# EAGLE schematic Stepper board_dual_voltage_v2 (EAGLE 9.3.1)
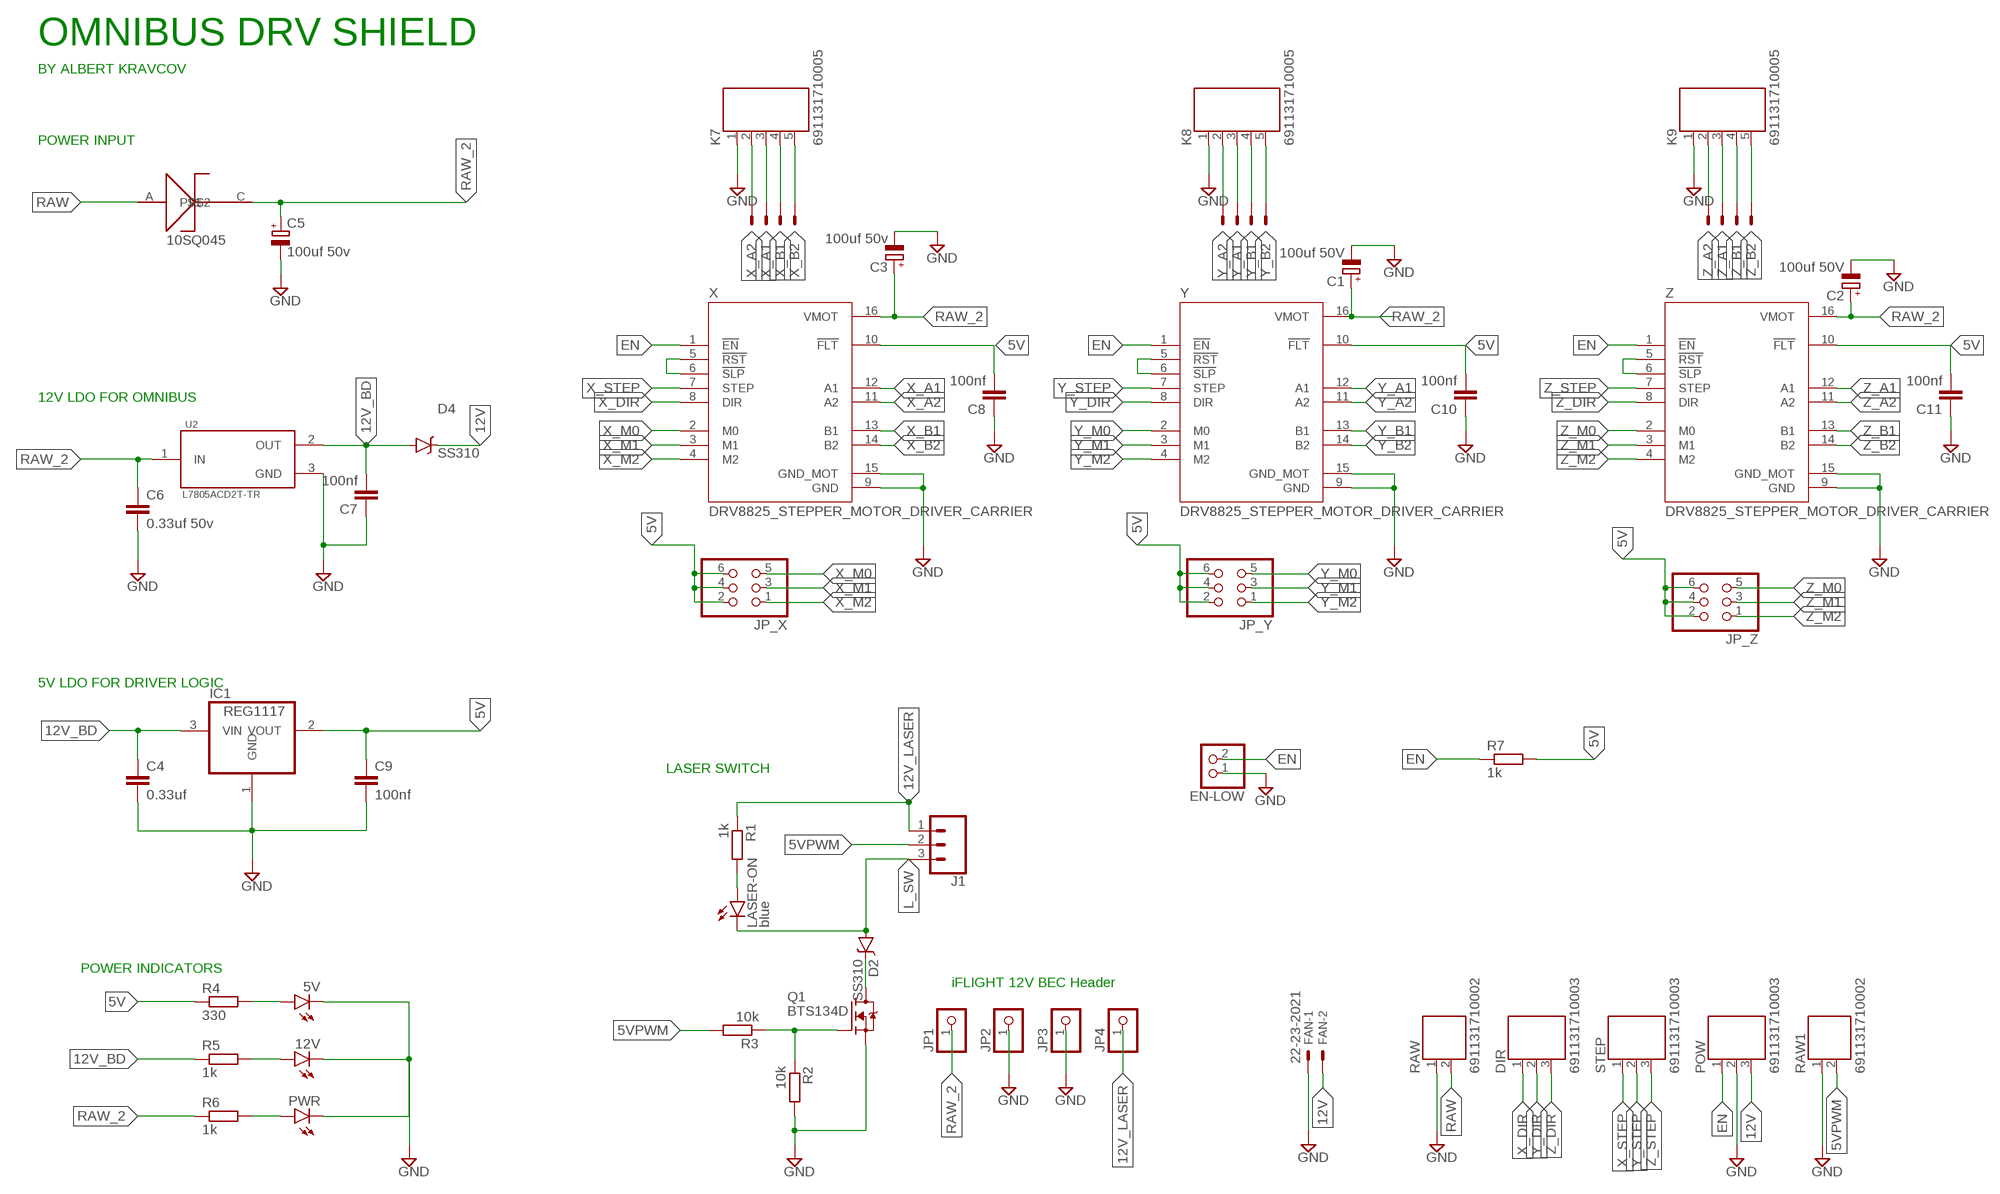
[diagram p0: schematic, sheet 1]

## Parts
5V  LEDCHIPLED_0805  [CHIPLED_0805]
12V  LEDCHIPLED_0805  [CHIPLED_0805]
C1  100uf 50V  CPOL-EUE5-6  [E5-6]
C2  100uf 50V  CPOL-EUE5-6  [E5-6]
C3  100uf 50v  CPOL-EUE5-6  [E5-6]
C4  0.33uf  C-EUC1206  [C1206]
C5  100uf 50v  CPOL-EUE5-8.5  [E5-8,5]
C6  0.33uf 50v  C-EUC1206  [C1206]
C7  100nf  C-EUC0805  [C0805]
C8  100nf  C-EUC0805  [C0805]
C9  100nf  C-EUC0805  [C0805]
C10  100nf  C-EUC0805  [C0805]
C11  100nf  C-EUC0805  [C0805]
D1  10SQ045  10SQ050  [DIOAD885W125L910D885]
D2  SS310  SS54  [DO-214AC]
D4  SS310  SS54  [DO-214AC]
DIR  691131710003  [691131710003]
EN-LOW  PINHD-1X2  [1X02]
FAN  22-23-2021  [22-23-2021]
IC1  REG1117  [SOT223]
J1  CONN_03  [1X03]
JP1  PINHD-1X1  [1X01]
JP2  PINHD-1X1  [1X01]
JP3  PINHD-1X1  [1X01]
JP4  PINHD-1X1  [1X01]
JP_X  PINHD-2X3  [2X03]
JP_Y  PINHD-2X3  [2X03]
JP_Z  PINHD-2X3  [2X03]
K7  691131710005  [691131710005]
K8  691131710005  [691131710005]
K9  691131710005  [691131710005]
LASER-ON  blue  LEDCHIPLED_0805  [CHIPLED_0805]
POW  691131710003  [691131710003]
PWR  LEDCHIPLED_0805  [CHIPLED_0805]
Q1  BTS134D  FQD7N10LTM  [TO-252]
R1  1k  R-EU_R0805  [R0805]
R2  10k  R-EU_R0805  [R0805]
R3  10k  R-EU_R0805  [R0805]
R4  330  R-EU_R0805  [R0805]
R5  1k  R-EU_R0805  [R0805]
R6  1k  R-EU_R1206  [R1206]
R7  1k  R-EU_R0805  [R0805]
RAW  691131710002  [691131710002]
RAW1  691131710002  [691131710002]
STEP  691131710003  [691131710003]
U2  L7805ACD2T-TR  [TO254P1515X470-3N]
X  DRV8825_STEPPER_MOTOR_DRIVER_CARRIER  [IC_DRV8825_STEPPER_MOTOR_DRIVER_CARRIER]
X_MOTOR  22-23-2041  [22-23-2041]
Y  DRV8825_STEPPER_MOTOR_DRIVER_CARRIER  [IC_DRV8825_STEPPER_MOTOR_DRIVER_CARRIER]
Y_MOTOR  22-23-2041  [22-23-2041]
Z  DRV8825_STEPPER_MOTOR_DRIVER_CARRIER  [IC_DRV8825_STEPPER_MOTOR_DRIVER_CARRIER]
Z_MOTOR  22-23-2041  [22-23-2041]

## Nets
5V [power]: C8.2 C9.1 C10.2 C11.2 IC1.2(VOUT) JP_X.2 JP_X.4 JP_X.6 JP_Y.2 JP_Y.4 JP_Y.6 JP_Z.2 JP_Z.4 JP_Z.6 R4.1 R7.2 X.10(!FLT) Y.10(!FLT) Z.10(!FLT)
5VPWM [power]: J1.2 R3.2 RAW1.2
12V [ha]: D4.C FAN.2 POW.3
12V_BD [ha]: C4.1 C7.2 D4.A IC1.3(VIN) R5.1 U2.2(OUT)
12V_LASER [ha]: J1.1 JP4.1 R1.1
EN: EN-LOW.2 POW.1 R7.1 X.1(!EN) Y.1(!EN) Z.1(!EN)
GND: 5V.C 12V.C C1.- C2.- C3.- C4.2 C5.- C6.2 C7.1 C8.1 C9.2 C10.1 C11.1 EN-LOW.1 FAN.1 IC1.1(GND) JP2.1 JP3.1 K7.1 K8.1 K9.1 POW.2 PWR.C Q1.3(S) R2.2 RAW1.1 RAW.1 U2.3(GND) X.9(GND) X.15(GND_MOT) Y.9(GND) Y.15(GND_MOT) Z.9(GND) Z.15(GND_MOT)
L_SW [power]: D2.A J1.3 LASER-ON.C
N$1: Q1.1(G) R2.1 R3.1
N$2: 5V.A R4.2
N$3: LASER-ON.A R1.2
N$4 [power]: D2.C Q1.T(D)
N$7: 12V.A R5.2
N$10: PWR.A R6.2
NC [power]: Z.5(!RST) Z.6(!SLP)
NC2 [power]: Y.5(!RST) Y.6(!SLP)
NC3 [power]: X.5(!RST) X.6(!SLP)
RAW [ha]: D1.A RAW.2
RAW_2 [ha]: C1.+ C2.+ C3.+ C5.+ C6.1 D1.C JP1.1 R6.1 U2.1(IN) X.16(VMOT) Y.16(VMOT) Z.16(VMOT)
X_A1 [ha]: K7.3 X.12(A1) X_MOTOR.3
X_A2 [ha]: K7.2 X.11(A2) X_MOTOR.4
X_B1 [ha]: K7.4 X.13(B1) X_MOTOR.2
X_B2 [ha]: K7.5 X.14(B2) X_MOTOR.1
X_DIR [power]: DIR.1 X.8(DIR)
X_M0: JP_X.5 X.2(M0)
X_M1: JP_X.3 X.3(M1)
X_M2: JP_X.1 X.4(M2)
X_STEP [power]: STEP.1 X.7(STEP)
Y_A1 [ha]: K8.3 Y.12(A1) Y_MOTOR.3
Y_A2 [ha]: K8.2 Y.11(A2) Y_MOTOR.4
Y_B1 [ha]: K8.4 Y.13(B1) Y_MOTOR.2
Y_B2 [ha]: K8.5 Y.14(B2) Y_MOTOR.1
Y_DIR [power]: DIR.2 Y.8(DIR)
Y_M0: JP_Y.5 Y.2(M0)
Y_M1: JP_Y.3 Y.3(M1)
Y_M2: JP_Y.1 Y.4(M2)
Y_STEP [power]: STEP.2 Y.7(STEP)
Z_A1 [ha]: K9.3 Z.12(A1) Z_MOTOR.3
Z_A2 [ha]: K9.2 Z.11(A2) Z_MOTOR.4
Z_B1 [ha]: K9.4 Z.13(B1) Z_MOTOR.2
Z_B2 [ha]: K9.5 Z.14(B2) Z_MOTOR.1
Z_DIR [power]: DIR.3 Z.8(DIR)
Z_M0: JP_Z.5 Z.2(M0)
Z_M1: JP_Z.3 Z.3(M1)
Z_M2: JP_Z.1 Z.4(M2)
Z_STEP [power]: STEP.3 Z.7(STEP)

## Notes on the sheet
- OMNIBUS DRV SHIELD
- BY ALBERT KRAVCOV
- POWER INPUT
- 10SQ045
- 12V LDO FOR OMNIBUS
- 5V LDO FOR DRIVER LOGIC
- LASER SWITCH
- POWER INDICATORS
- iFLIGHT 12V BEC Header

## Library data of the parts
5V 12V LASER-ON PWR = led:LED: LED OSRAM: - CHIPLED LG R971, LG N971, LY N971, LG Q971, LY Q971, LO R971, LY R971 LH N974, LH R974 LS Q976, LO Q976, LY Q976 LO Q996 - Hyper CHIPLED LW Q18S LB Q993, LB Q99A, LB R99A - SideLED LS A670, LO A670, LY A670, LG A670, LP A670 LB A673, LV A673, LT A673, LW A673 LH A674 LY A675 LS A676, LA A676, LO A676, LY A676, LW A676 LS A679, LY A679, LG A679 - Hyper Micro SIDELED® LS Y876, LA Y876, LO Y876, LY Y876 LT Y87S - SmartLED LW L88C, LW L88S LB L89C, LB L89S, LG L890 LS L89K, LO L89K, LY L89K LS L896, LA L896, LO L896, LY L896 - TOPLED LS T670, LO T670, LY T670, LG T670, LP T670 LSG T670, LSP T670, LSY T670, LOP T670, LYG T670 LG T671, LOG T671, LSG T671 LB T673, LV T673, LT T673, LW T673 LH T674 LS T676, LA T676, LO T676, LY T676, LB T676, LH T676, LSB T676, LW T676 LB T67C, LV T67C, LT T67C, LS T67K, LO T67K, LY T67K, LW E67C LS E67B, LA E67B, LO E67B, LY E67B, LB E67C, LV E67C, LT E67C LW T67C LS T679, LY T679, LG T679 LS T770, LO T770, LY T770, LG T770, LP T770 LB T773, LV T773, LT T773, LW T773 LH T774 LS E675, LA E675, LY E675, LS T675 LS T776, LA T776, LO T776, LY T776, LB T776 LHGB T686 LT T68C, LB T68C - Hyper Mini TOPLED® LB M676 - Mini TOPLED Santana® LG M470 LS M47K, LO M47K, LY M47K Source: http://www.osram.convergy.de LUXEON: - LUMILED® LXK2-PW12-R00, LXK2-PW12-S00, LXK2-PW14-U00, LXK2-PW14-V00 LXK2-PM12-R00, LXK2-PM12-S00, LXK2-PM14-U00 LXK2-PE12-Q00, LXK2-PE12-R00, LXK2-PE12-S00, LXK2-PE14-T00, LXK2-PE14-U00 LXK2-PB12-K00, LXK2-PB12-L00, LXK2-PB12-M00, LXK2-PB14-N00, LXK2-PB14-P00, LXK2-PB14-Q00 LXK2-PR12-L00, LXK2-PR12-M00, LXK2-PR14-Q00, LXK2-PR14-R00 LXK2-PD12-Q00, LXK2-PD12-R00, LXK2-PD12-S00 LXK2-PH12-R00, LXK2-PH12-S00 LXK2-PL12-P00, LXK2-PL12-Q00, LXK2-PL12-R00 Source: www.luxeon.com KINGBRIGHT: KA-3528ASYC Source: www.kingbright.com
C1-C3 C5 = rcl:CPOL-EU: POLARIZED CAPACITOR, European symbol; SPICEPREFIX: C
C4 C6-C11 = rcl:C-EU: CAPACITOR, European symbol; SPICEPREFIX: C
D1 = DIOAD885W125L910D885:10SQ050
D2 D4 = SS54:SS54: SCHOTTKY DIODES 40Vpeak, 28Vrms 5A (SBD) SMA(DO-214AC); AVAILABILITY: Unavailable; DESCRIPTION: Digital Switch Unipolar Switch Open Collector Hall Effect SOT-89B; MF: Honeywell Sensing; MP: SS54; PACKAGE: TO-243AA-243 Honeywell Sensing; PRICE: None
DIR POW STEP = Wurth_Terminal_Blocks_Connectors_rev15d:691131710003: WR-TBL Terminal block - CUU5/3 - 3 Pins;=>Code : Con_TBL_Screw_PClamp_5.00_6911317100xx_691131710003 <http://katalog.we-online.de/media/images/eican/Con_TBL_Screw_PClamp_5.00_6911317100xx_pf2.jpg> Details see: http://katalog.we-online.de/em/datasheet/6911317100xx.pdf Created 11/3/2014, Karrer Zheng 2014 (C) Wurth Elektronik
EN-LOW = pinhead:PINHD-1X2: PIN HEADER
FAN = con-molex:22-23-2021: .100" (2.54mm) Center Header - 2 Pin; MF: MOLEX; MPN: 22-23-2021; OC_FARNELL: 1462926; OC_NEWARK: 25C3832
IC1 = burr-brown:REG1117: 800mA and 1A Low Dropout (LDO) Positive Regulator 1.8V, 2.5V, 2.85V, 3.3V, 5V, and Adj; MPN: REG1117; OC_FARNELL: 1097566; OC_NEWARK: 14P6981
J1 = SparkFun-Connectors:CONN_03: Multi connection point. Often used as Generic Header-pin footprint for 0.1 inch spaced/style header connections On any of the 0.1 inch spaced packages, you can populate with these: Break Away Headers - Straight <https://www.sparkfun.com/products/116> (PRT-00116) Break Away Male Headers - Right Angle <https://www.sparkfun.com/products/553> (PRT-00553) Female Headers <https://www.sparkfun.com/products/115> (PRT-00115) Break Away Headers - Machine Pin <https://www.sparkfun.com/products/117> (PRT-00117) Break Away Female Headers - Swiss Machine Pin <https://www.sparkfun.com/products/743> (PRT-00743) Stackable Header - 3 Pin (Female, 0.1") <https://www.sparkfun.com/products/13875> (PRT-13875) For SCREWTERMINALS and SPRING TERMINALS visit here: Screw Terimnals on SparkFun.com <https://www.sparkfun.com/search/results?term=Screw+Terminals> (5mm/3.5mm/2.54mm spacing) This device is also useful as a general connection point to wire up your design to another part of your project. Our various solder wires solder well into these plated through hole pads. Hook-Up Wire - Assortment (Stranded, 22 AWG) <https://www.sparkfun.com/products/11375> (PRT-11375) Hook-Up Wire - Assortment (Solid Core, 22 AWG) <https://www.sparkfun.com/products/11367> (PRT-11367) View the entire wire category on our website here <https://www.sparkfun.com/categories/141> Special notes: Molex polarized connector foot print use with SKU : PRT-08232 with associated crimp pins and housings.
JP1-JP4 = pinhead:PINHD-1X1: PIN HEADER
JP_X JP_Y JP_Z = pinhead:PINHD-2X3: PIN HEADER
K7-K9 = Wurth_Terminal_Blocks_Connectors_rev15d:691131710005: WR-TBL Terminal block - CUU5/5 - 5 Pins;=>Code : Con_TBL_Screw_PClamp_5.00_6911317100xx_691131710005 <http://katalog.we-online.de/media/images/eican/Con_TBL_Screw_PClamp_5.00_6911317100xx_pf2.jpg> Details see: http://katalog.we-online.de/em/datasheet/6911317100xx.pdf Created 11/3/2014, Karrer Zheng 2014 (C) Wurth Elektronik
Q1 = FQD7N10LTM:FQD7N10LTM: MOSFET N-CH 100V 5.8A 350mOhm 6nC DPAK Check prices <https://pricing.snapeda.com/parts/FQD7N10LTM/ON%20Semiconductor/view-part?ref=eda>; AVAILABILITY: Good; DESCRIPTION: N-Channel 100V 5.8A (Tc) 2.5W (Ta), 25W (Tc) Surface Mount D-Pak; MF: ON Semiconductor; MP: FQD7N10LTM; PACKAGE: TO-252-3 ON Semiconductor; PRICE: None; PURCHASE-URL: https://pricing.snapeda.com/search/part/FQD7N10LTM/?ref=eda
R1-R7 = rcl:R-EU_: RESISTOR, European symbol; SPICEPREFIX: R
RAW RAW1 = Wurth_Terminal_Blocks_Connectors_rev15d:691131710002: WR-TBL Terminal block - CUU5/2 CUU5/2GR - 2 Pins;=>Code : Con_TBL_Screw_PClamp_5.00_6911317100xx_691131710002 <http://katalog.we-online.de/media/images/eican/Con_TBL_Screw_PClamp_5.00_6911317100xx_pf2.jpg> Details see: http://katalog.we-online.de/em/datasheet/6911317100xx.pdf Created 11/23/2014, Karrer Zheng 2014 (C) Wurth Elektronik
U2 = L7805ACD2T-TR:L7805ACD2T-TR: Positive voltage regulator ICs Check prices <https://pricing.snapeda.com/parts/L7805ACD2T-TR/STMicroelectronics/view-part?ref=eda>; AVAILABILITY: Good; DESCRIPTION: Linear Voltage Regulator IC Positive Fixed 1 Output 1.5A D2PAK; MF: STMicroelectronics; MP: L7805ACD2T-TR; PACKAGE: D2PAK STMicroelectronics; PRICE: None; PURCHASE-URL: https://pricing.snapeda.com/search/part/L7805ACD2T-TR/?ref=eda
X Y Z = DRV8825_STEPPER_MOTOR_DRIVER_CARRIER:DRV8825_STEPPER_MOTOR_DRIVER_CARRIER: Stepper motor controler; IC: DRV8825; 1.5A; Uin mot: 8.2÷45V; AVAILABILITY: Unavailable; DESCRIPTION: Stepper, Bipolar 8.2 ~ 45VDC Supply 1.5A 8.2 ~ 45V Load; MF: Pololu; MP: DRV8825 STEPPER MOTOR DRIVER CARRIER; PACKAGE: None; PRICE: None
X_MOTOR Y_MOTOR Z_MOTOR = con-molex:22-23-2041: .100" (2.54mm) Center Header - 4 Pin; MF: MOLEX; MPN: 22-23-2041; OC_FARNELL: 1462920; OC_NEWARK: 38C0355

## Net classes
0 default: width 0.305 mm, drill 0.305 mm, clearance 0.305 mm
1 power: width 0.635 mm, drill 0.635 mm, clearance 0.635 mm
2 ha: width 1.524 mm, drill 0.762 mm, clearance 1.27 mm